# EAGLE design Reaccion-Minimo (EAGLE 7.4.0)
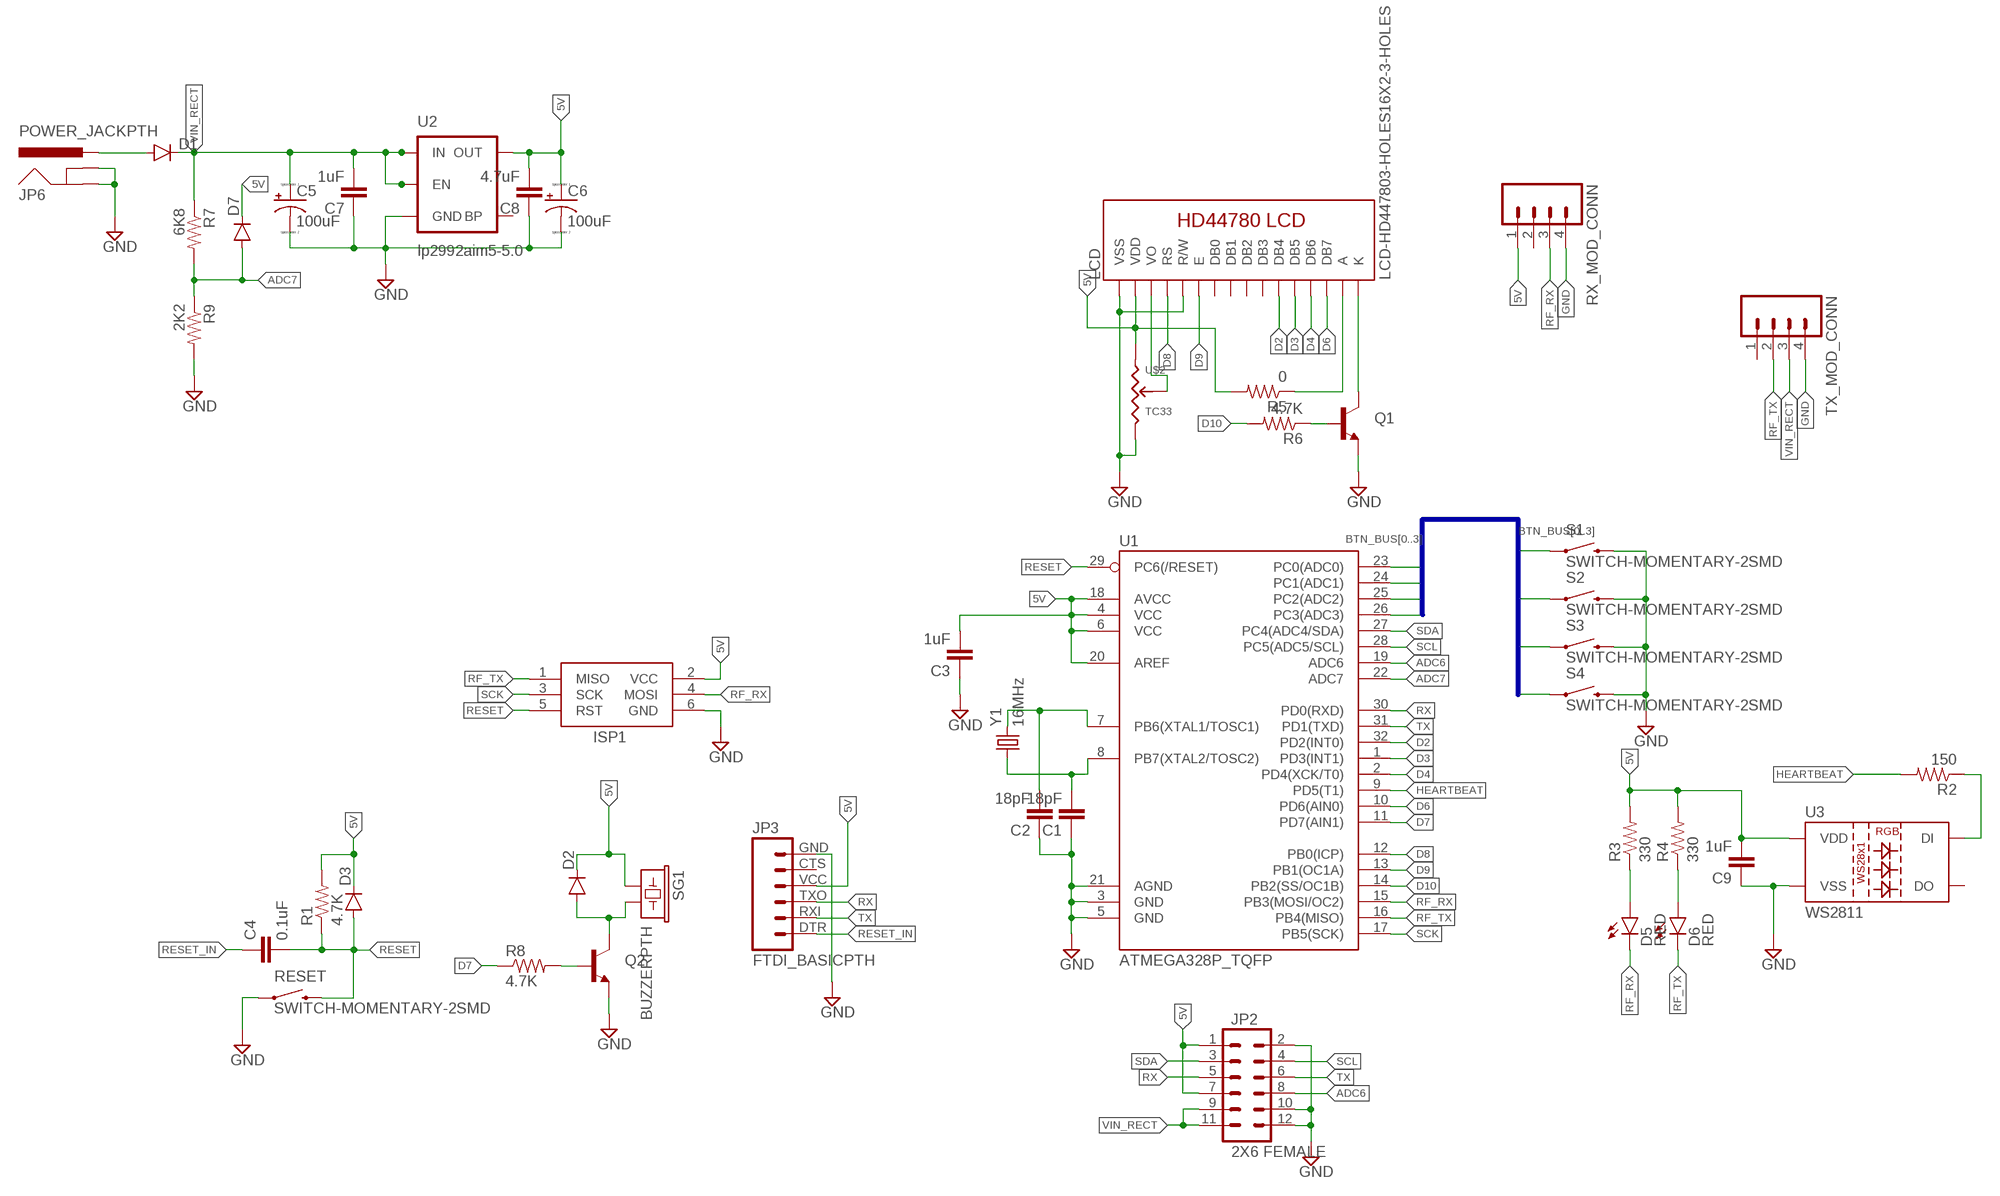
[diagram p0: schematic, sheet 1]

## Parts
C1  18pF  CAP0805  [0805]
C2  18pF  CAP0805  [0805]
C3  1uF  CAP0805  [0805]
C4  0.1uF  CAP0805  [0805]
C5  100uF  CPOL-USC/6032-28R  [C/6032-28R]
C6  100uF  CPOL-USB/3528-21R  [T/3528-12R]
C7  1uF  CAP0805  [0805]
C8  4.7uF  CAP0805  [0805]
C9  1uF  CAP0805  [0805]
D1  DIODESMB  [SMB-DIODE]
D2  DIODESOD123  [SOD-123]
D3  DIODESOD123  [SOD-123]
D5  RED  LED-RED1206  [LED-1206]
D6  RED  LED-RED1206  [LED-1206]
D7  DIODESOD123  [SOD-123]
ISP1  AVRISP-6  [AVRISP]
JP2  2X6 FEMALE  M06X2PTH_FEMALE  [2X6]
JP3  FTDI_BASICPTH  [FTDI_BASIC]
JP6  POWER_JACKPTH  [POWER_JACK_PTH]
LCD  LCD-HD447803-HOLES16X2-3-HOLES  [LCD-16X2-3HOLES]
Q1  TRANSISTOR_NPNSOT23-3  [SOT23-3]
Q2  TRANSISTOR_NPNSOT23-3  [SOT23-3]
R1  4.7K  RESISTOR0805-RES  [0805]
R2  150  RESISTOR0805-RES  [0805]
R3  330  RESISTOR0805-RES  [0805]
R4  330  RESISTOR0805-RES  [0805]
R5  0  RESISTOR0805-RES  [0805]
R6  4.7K  RESISTOR0805-RES  [0805]
R7  6K8  RESISTOR0805-RES  [0805]
R8  4.7K  RESISTOR0805-RES  [0805]
R9  2K2  RESISTOR0805-RES  [0805]
RESET  SWITCH-MOMENTARY-2SMD  [TACTILE-SWITCH-SMD]
RX_MOD_CONN  M04PTH  [1X04]
S1  SWITCH-MOMENTARY-2SMD  [TACTILE-SWITCH-SMD]
S2  SWITCH-MOMENTARY-2SMD  [TACTILE-SWITCH-SMD]
S3  SWITCH-MOMENTARY-2SMD  [TACTILE-SWITCH-SMD]
S4  SWITCH-MOMENTARY-2SMD  [TACTILE-SWITCH-SMD]
SG1  BUZZERPTH  [BUZZER-12MM]
TX_MOD_CONN  M04PTH  [1X04]
U1  ATMEGA328P_TQFP  [TQFP32-08]
U2  lp2992aim5-5.0  V_REG_MIC52195V  [SOT23-5]
U3  WS2811  LED-TRICOLOR-5050-ICWS2811  [LED-TRICOLOR-5050-IC]
U$2  TC33  [TC33]
Y1  16MHz  CRYSTAL5X3  [CRYSTAL-SMD-5X3]

## Nets
5V: C3.2 C6.+ C8.2 C9.2 D2.C D3.C D7.C ISP1.2(VCC) JP2.1 JP2.7 JP3.VCC LCD.2(VDD) R1.2 R3.2 R4.2 R5.2 RX_MOD_CONN.1 SG1.+ U1.4(VCC) U1.6(VCC) U1.18(AVCC) U1.20(AREF) U2.5(OUT) U3.3(VDD) U3.5(VDD) U$2.1
ADC6: JP2.8 U1.19(ADC6)
ADC7: D7.A R7.2 R9.1 U1.22(ADC7)
BTN_BUS0: S1.1 U1.23(PC0(ADC0))
BTN_BUS1: S2.1 U1.24(PC1(ADC1))
BTN_BUS2: S3.1 U1.25(PC2(ADC2))
BTN_BUS3: S4.1 U1.26(PC3(ADC3))
D2: LCD.11(DB4) U1.32(PD2(INT0))
D3: LCD.12(DB5) U1.1(PD3(INT1))
D4: LCD.13(DB6) U1.2(PD4(XCK/T0))
D6: LCD.14(DB7) U1.10(PD6(AIN0))
D7: R8.1 U1.11(PD7(AIN1))
D8: LCD.4(RS) U1.12(PB0(ICP))
D9: LCD.6(E) U1.13(PB1(OC1A))
D10: R6.2 U1.14(PB2(SS/OC1B))
GND: C1.1 C2.1 C3.1 C5.- C6.- C7.1 C8.1 C9.1 ISP1.6(GND) JP2.2 JP2.10 JP2.12 JP3.GND JP6.GND JP6.GNDBREAK LCD.1(VSS) LCD.5(R/W) Q1.2(E) Q2.2(E) R9.2 RESET.1 RX_MOD_CONN.4 S1.3 S2.3 S3.3 S4.3 TX_MOD_CONN.4 U1.3(GND) U1.5(GND) U1.21(AGND) U2.2(GND) U3.6(VSS) U$2.3
HEARTBEAT: R2.2 U1.9(PD5(T1))
N$1: C2.2 U1.7(PB6(XTAL1/TOSC1)) Y1.3
N$2: C1.2 U1.8(PB7(XTAL2/TOSC2)) Y1.1
N$3: R2.1 U3.2(DI)
N$4: D5.A R3.1
N$5: D6.A R4.1
N$6: LCD.15(A) R5.1
N$7: LCD.3(VO) U$2.2
N$8: LCD.16(K) Q1.3(C)
N$9: Q1.1(B) R6.1
N$11: D2.A Q2.3(C) SG1.-
N$12: Q2.1(B) R8.2
RESET: C4.2 D3.A ISP1.5(RST) R1.1 RESET.3 U1.29(PC6(/RESET))
RESET_IN: C4.1 JP3.DTR
RF_RX: D5.C ISP1.4(MOSI) RX_MOD_CONN.3 U1.15(PB3(MOSI/OC2))
RF_TX: D6.C ISP1.1(MISO) TX_MOD_CONN.2 U1.16(PB4(MISO))
RX: JP2.5 JP3.TXO U1.30(PD0(RXD))
SCK: ISP1.3(SCK) U1.17(PB5(SCK))
SCL: JP2.4 U1.28(PC5(ADC5/SCL))
SDA: JP2.3 U1.27(PC4(ADC4/SDA))
TX: JP2.6 JP3.RXI U1.31(PD1(TXD))
VIN: D1.A JP6.PWR
VIN_RECT: C5.+ C7.2 D1.C JP2.9 JP2.11 R7.1 TX_MOD_CONN.3 U2.1(IN) U2.3(EN)
Unconnected: JP3.CTS LCD.7(DB0) LCD.8(DB1) LCD.9(DB2) LCD.10(DB3) RX_MOD_CONN.2 TX_MOD_CONN.1 U2.4(BP) U3.1(DO)

## Buses
BTN_BUS[0..3]

## Library data of the parts
C1-C4 C7-C9 = SparkFun-Capacitors:CAP: Capacitor Standard 0603 ceramic capacitor, and 0.1" leaded capacitor.
C5 C6 = resistor:CPOL-US: POLARIZED CAPACITOR, American symbol
D1 = SparkFun-DiscreteSemi:DIODE: Diode These are standard reverse protection diodes and small signal diodes. SMA package can handle up to about 1A. SOD-323 can handle about 200mA. What the SOD-323 package when ordering, there are some mfgs out there that are 5-pin packages.; PROD_ID: DIO-09646
D2 D3 D7 = SparkFun-DiscreteSemi:DIODE: Diode These are standard reverse protection diodes and small signal diodes. SMA package can handle up to about 1A. SOD-323 can handle about 200mA. What the SOD-323 package when ordering, there are some mfgs out there that are 5-pin packages.
D5 D6 = SparkFun-LED:LED-RED: Assorted Red LEDs LilyPad 1206- DIO-09912 1206- DIO-00809 0603- DIO-00819 "SMART" means more efficient and expensive; PROD_ID: DIO-09912
ISP1 = adafruit:AVRISP: AVR ISP HEADER Standard 6 pin header for AVR programming
JP2 = SparkFun-Connectors:M06X2; PROD_ID: CONN-12423
JP3 = SparkFun-Connectors:FTDI_BASIC: FTDI Basic header with labels
JP6 = SparkFun-Connectors:POWER_JACK: Power Jack This is the standard 5.5mm barrel jack for power. The PTH is the most common, proven, reliable, footprint. The Slot footprint only works if the mill layer is transmitted to the PCB fab house so be warned. Mating wall wart : TOL-00298 (and others); PROD_ID: CONN-08197
LCD = HD44780LCD:LCD-HD44780
Q1 Q2 = SparkFun-DiscreteSemi:TRANSISTOR_NPN: Generic NPN BJT MMBT2222A - TRANS-08049 (SOT-23, 1A 40V) MPSA42 - TRANS-09116 (SOT-23, 500mA 300V) MMBT5088LT1G - TRANS-11160 (SOT-23, 50 mA 30V) BC547 - COM-08928 <http://www.sparkfun.com/products/8928> (TO-92 45V 100mA) (1.Collector 2.Base 3.Emitter) 2N3904 - COM-00521 <http://www.sparkfun.com/products/521> (TO-92 40V 200mA) (1.Emitter 2.Base 3.Collector) P2N2222A - COM-12852 <http://www.sparkfun.com/products/12852> (TO-92 40V 600mA) (1.Collector 2.Base 3.Emitter); PROD_ID: TRANS-08049
R1-R9 = SparkFun-Resistors:RESISTOR: Resistor Basic schematic elements and footprints for 0603, 1206, and PTH resistors.
RESET S1-S4 = SparkFun-Electromechanical:SWITCH-MOMENTARY-2: Various NO switches- pushbuttons, reed, etc; PROD_ID: SWCH-08247
RX_MOD_CONN TX_MOD_CONN = SparkFun-Connectors:M04: Header 4 Standard 4-pin 0.1" header. Use with straight break away headers (SKU : PRT-00116), right angle break away headers (PRT-00553), swiss pins (PRT-00743), machine pins (PRT-00117), and female headers (PRT-00115). Molex polarized connector foot print use with SKU : PRT-08231 with associated crimp pins and housings. 1MM SMD Version SKU: PRT-10208
SG1 = SparkFun-Electromechanical:BUZZER: Buzzer 12mm Spark Fun Electronics SKU : Comp-Buzzer
U1 = SparkFun-DigitalIC:ATMEGA328P_TQFP; PROD_ID: IC-09069
U2 = SparkFun-PowerIC:V_REG_MIC5219: V_REG MIC5219 Standard 3.3V and 5V 500mA LDO voltage regulator in SOT-23 layout. Micrel part MIC5219. BP (by-pass) pin is used to lower output noise with 470pF cap, may be left open.; PROD_ID: VREG-10107; VALUE: MIC5219 5V
U3 = SparkFun-LED:LED-TRICOLOR-5050-IC: WS2812 RGB LED w/ WS2811 driver 5x5mm SMD LED with built-in controller IC. DIO-11598; PROD_ID: DIO-11598
U$2 = Reaccion-Minimo:TC33
Y1 = SparkFun-FreqCtrl:CRYSTAL: Various standard crystals. Proven footprints.; PROD_ID: XTAL-08218

## Board
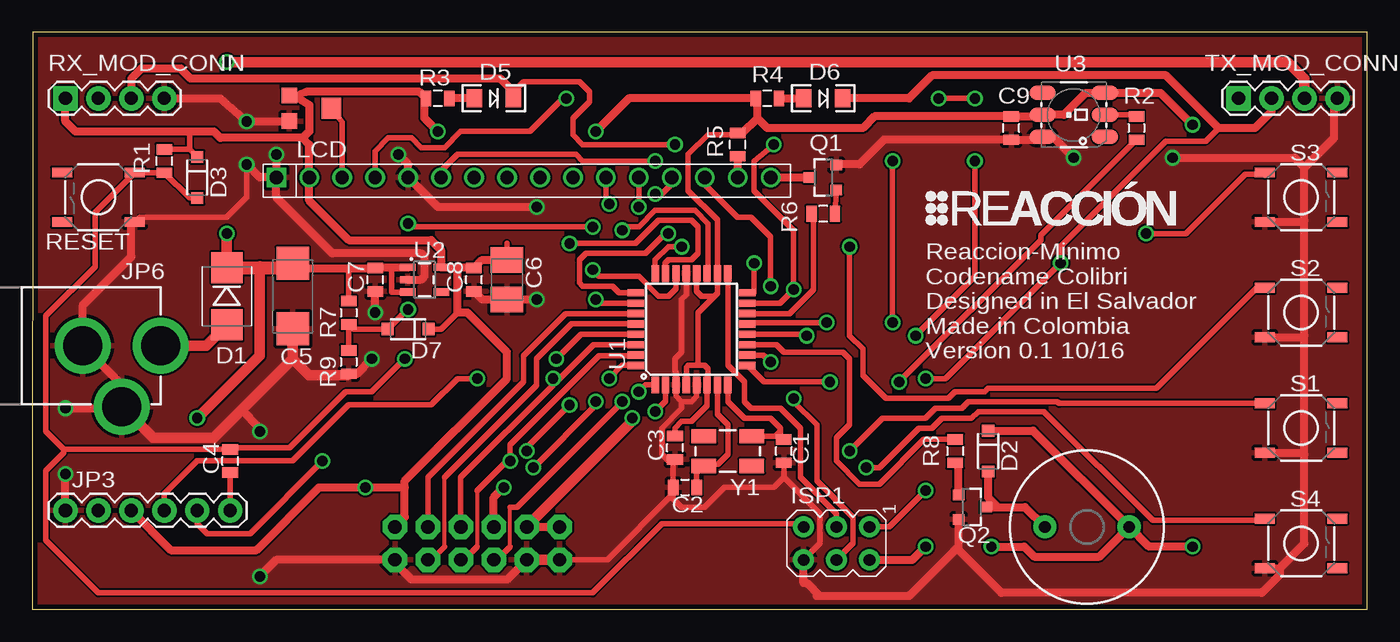
[diagram p1: board, top side]
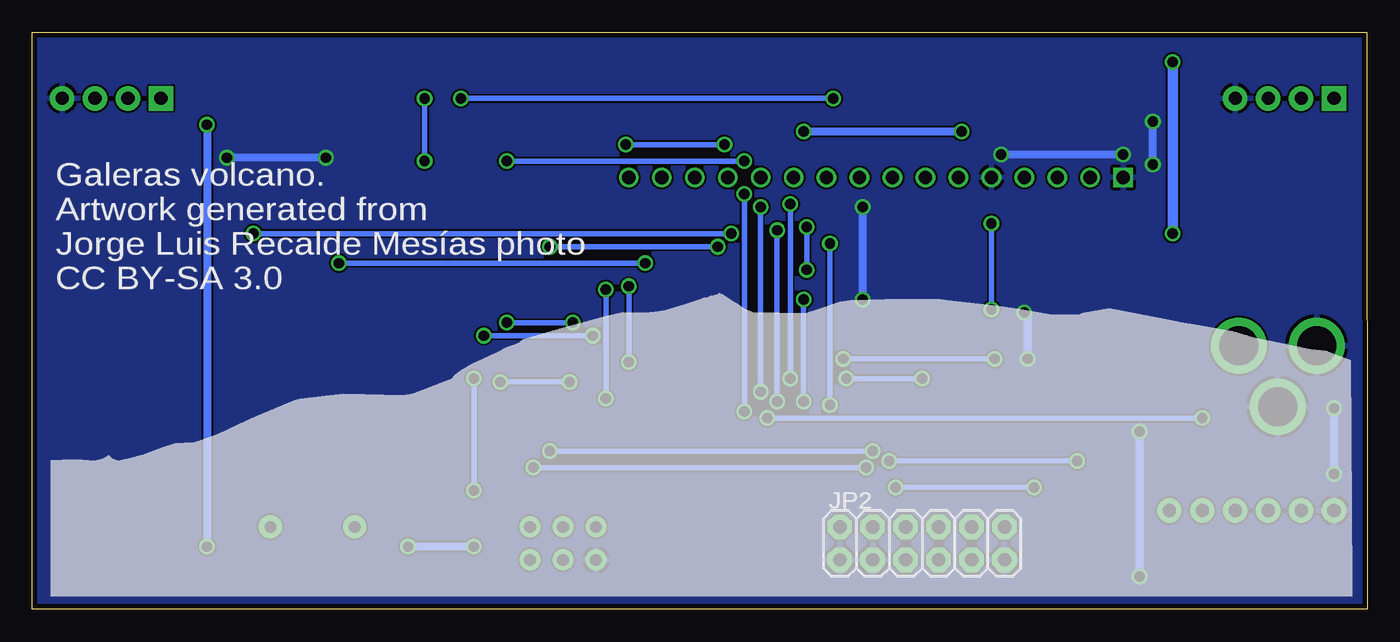
[diagram p2: board, bottom side, seen from below]

Size 102.87 x 44.45 mm. Coordinates in mm from the lower left corner, seen from the top.
Outline: 0,0 102.87,0 102.87,44.45 0.01,44.45 0,0
Copper layers (1*16): Top 0.0356mm / dielectric 1.5011mm / Bottom 0.0356mm
Design rules "LaenPCBOrder": minimum track width 6mil, minimum drill 13mil, track to track 6mil, track to pad 6mil, pad to pad 6mil, via to via 6mil, smd to smd 6mil, copper to edge 15mil, drill to drill 6mil, minimum pad ring 7mil, minimum via ring 7mil, stop-mask expansion 3mil, vias tented up to drill 0mil, thermal gap 10mil

### Footprints (pad centres in the part's own frame; a part is rotated, then mirrored left to right if it is on the bottom)
0805 = smd 0.8 x 1.2: 1 -0.9,0; 2 0.9,0
C/6032-28R = smd 2.55 x 2.5: + 2.525,0; - -2.525,0
T/3528-12R = smd 1.95 x 2.5: + 1.525,0; - -1.525,0
SMB-DIODE = smd 2.4 x 2.4: A 2.2,0; C -2.2,0
SOD-123 = smd 0.9 x 0.95: A 1.575,0; C -1.575,0
LED-1206 = smd 1.2 x 1.4: A -1.5,0; C 1.5,0
AVRISP = drill 0.9 pad 1.626: 1 -1.27,2.54; 2 1.27,2.54; 3 -1.27,0; 4 1.27,0; 5 -1.27,-2.54; 6 1.27,-2.54
2X6 = drill 1.016 pad 1.88 octagon: 1 0,0; 2 0,2.54; 3 2.54,0; 4 2.54,2.54; 5 5.08,0; 6 5.08,2.54; 7 7.62,0; 8 7.62,2.54; 9 10.16,0; 10 10.16,2.54; 11 12.7,0; 12 12.7,2.54
FTDI_BASIC = drill 1.016 pad 1.88: CTS 10.16,0; DTR 0,0; GND 12.7,0; RXI 2.54,0; TXO 5.08,0; VCC 7.62,0
POWER_JACK_PTH = drill 2.997 pad 4.318: GND 0,7.7; GNDBREAK 4.7,10.7; PWR 0,13.7
LCD-16X2-3HOLES = drill 1.016 square: 1 -32,15.5 | drill 1.016: 2 -29.46,15.5; 3 -26.92,15.5; 4 -24.38,15.5; 5 -21.84,15.5; 6 -19.3,15.5; 7 -16.76,15.5; 8 -14.22,15.5; 9 -11.68,15.5; 10 -9.14,15.5; 11 -6.6,15.5; 12 -4.06,15.5; 13 -1.52,15.5; 14 1.02,15.5; 15 3.56,15.5; 16 6.1,15.5
SOT23-3 = smd 0.8 x 0.9: 1 -0.95,-1; 2 0.95,-1; 3 0,1.1
TACTILE-SWITCH-SMD = smd 1.524 x 0.762: 1 -2.794,1.905; 2 2.794,1.905; 3 -2.794,-1.905; 4 2.794,-1.905
1X04 = drill 1.016 pad 1.88 square: 1 0,0 | drill 1.016 pad 1.88: 2 2.54,0; 3 5.08,0; 4 7.62,0
BUZZER-12MM = drill 0.9 pad 1.778: + 3.25,0; - -3.25,0
TQFP32-08 = smd 1.27 x 0.559: 1 -4.293,2.8; 2 -4.293,2; 3 -4.293,1.2; 4 -4.293,0.4; 5 -4.293,-0.4; 6 -4.293,-1.2; 7 -4.293,-2; 8 -4.293,-2.8; 17 4.293,-2.8; 18 4.293,-2; 19 4.293,-1.2; 20 4.293,-0.4; 21 4.293,0.4; 22 4.293,1.2; 23 4.293,2; 24 4.293,2.8 | smd 0.559 x 1.27: 9 -2.8,-4.293; 10 -2,-4.293; 11 -1.2,-4.293; 12 -0.4,-4.293; 13 0.4,-4.293; 14 1.2,-4.293; 15 2,-4.293; 16 2.8,-4.293; 25 2.8,4.293; 26 2,4.293; 27 1.2,4.293; 28 0.4,4.293; 29 -0.4,4.293; 30 -1.2,4.293; 31 -2,4.293; 32 -2.8,4.293
SOT23-5 = smd 0.55 x 1.2: 1 -0.95,-1.3; 2 0,-1.3; 3 0.95,-1.3; 4 0.95,1.3; 5 -0.95,1.3
LED-TRICOLOR-5050-IC = smd 2 x 1.1: 1 -2.4,1.7; 2 -2.4,0; 3 -2.4,-1.7; 4 2.4,-1.7; 5 2.4,0; 6 2.4,1.7
TC33 = smd 1.194 x 1.194: 1 -0.991,-1.791; 3 0.991,-1.791 | smd 1.6 x 1.499: 2 0,1.46
CRYSTAL-SMD-5X3 = smd 1.9 x 1.1: 1 -1.85,-1.15; 2 1.85,-1.15; 3 1.85,1.15; 4 -1.85,1.15

### Placement (x,y rotation side)
C1  57.91,12.19 90 top
C2  50.29,9.4 0 top
C3  49.53,12.45 90 top
C4  15.24,11.43 90 top
C5  20.07,24.13 90 top
C6  36.58,25.4 90 top
C7  26.42,25.4 90 top
C8  34.04,25.4 90 top
C9  75.44,37.08 90 top
D1  14.99,24.13 270 top
D2  73.66,12.19 270 top
D3  12.7,33.27 270 top
D5  35.56,39.37 0 top
D6  60.96,39.37 0 top
D7  28.96,21.59 180 top
ISP1  61.98,5.08 270 top
JP2  27.94,6.35 180 bottom
JP3  15.24,7.62 180 top
JP6  -3.81,20.32 270 top
LCD  50.8,17.78 0 top
Q1  60.96,33.27 90 top
Q2  72.39,7.87 270 top
R1  10.16,34.54 90 top
R2  85.09,37.08 270 top
R3  31.24,39.37 180 top
R4  56.64,39.37 180 top
R5  54.36,35.81 90 top
R6  60.96,30.48 180 top
R7  24.38,22.86 270 top
R8  71.12,12.19 270 top
R9  24.38,19.05 270 top
RESET  5.08,31.75 180 top
RX_MOD_CONN  2.54,39.37 0 top
S1  97.79,13.97 0 top
S2  97.79,22.86 0 top
S3  97.79,31.75 0 top
S4  97.79,5.08 0 top
SG1  81.28,6.35 0 top
TX_MOD_CONN  92.96,39.37 0 top
U1  50.8,21.59 90 top
U2  30.23,25.4 270 top
U3  80.26,38.1 180 top
U$2  21.59,38.61 270 top
Y1  53.59,12.19 180 top

### Tracks (layer width: path | path; a pad name or v marks a point on that pad's centre or on a via)
5V  (via drill 0.8)
  Top 0.406: D7.C 31.5,21.59 32.77,22.86 | R1.2 12.11,35.44 | 12.11,35.44 D3.C | 12.11,35.44 12.11,36.74 12.19,36.83 | 20.6,39.65 20.6,39.34 | 30.23,39.25 R3.2 | 52.58,24.13 52.8,24.35 U1.18 52.8,30 50.55,32.26 50.55,35.05 52.07,36.58 54.22,36.58 R5.2 | 52.58,24.13 51.56,24.13 51.2,24.49 U1.20 | 52.58,24.13 51.31,22.86 51.31,18.8 | 51.31,18.8 51.82,18.8 52.07,18.54 52.07,17.37 U1.6 | U1.6 52,17.34 | U1.4 50.4,18.65 50.55,18.8 51.31,18.8 | U1.6 52,15.68 50.8,14.48 50.04,14.48 49.53,13.97 C3.2 | 36.58,28.19 C6.+
  Top 0.61: 32.77,26.35 U2.5 31.5,26.38 31.5,27.69 30.73,28.45 24.38,28.45 21.34,31.5 LCD.2 21.34,35.81 20.83,36.32 | 32.77,26.35 33.99,26.35 arc-90 C8.2 34.66,26.93 C6.+ | 32.77,26.35 32.77,22.86 33.53,22.86 36.58,19.81 36.58,17.78 28.7,9.91 28.7,9.4 | RX_MOD_CONN.1 2.54,37.59 3.3,36.83 12.19,36.83 13.97,36.83 14.48,36.32 20.83,36.32 | U$2.1 20.6,39.34 21.34,38.86 21.34,36.83 20.83,36.32 | R3.2 29.83,39.88 21.08,39.88 20.6,39.65 | v43.43,36.83 45.97,39.37 R4.2 55.88,39.23 55.88,37.85 | v31.24,36.83 30.23,37.85 30.23,39.25 | 55.88,37.85 56.64,37.08 64.01,37.08 64.91,37.98 C9.2 77.75,37.98 U3.5 79.5,38.1 81.2,39.8 U3.3 86.95,39.8 v89.41,37.34 | R5.2 54.75,36.71 55.88,37.85 | JP2.1 28.7,7.11 28.7,9.4 | JP2.7 35.56,8.64 v36.32,9.4 | 28.7,9.4 v25.65,9.4 22.1,9.4 17.27,4.57 10.67,4.57 JP3.VCC | ISP1.2 67.82,3.81 v68.83,4.83 | v73.91,4.83 76.45,4.83 77.22,4.06 82.24,4.06 SG1.+ | D2.C 77.11,13.77 SG1.+ | v89.41,4.83 86.05,4.83 SG1.+
  Bottom 0.406: v36.32,9.4 v25.65,9.4
  Bottom 0.61: v43.43,36.83 v31.24,36.83 | v68.83,4.83 v73.91,4.83 | v89.41,37.34 v89.41,4.83
ADC6  (via drill 0.8)
  Top 0.305: 36.83,4.83 36.83,7.87
  Top 0.406: JP2.8 35.81,3.81 36.83,4.83 | U1.19 52.07,25.95 52.07,29.72 51.05,30.73 48.01,30.73 46.74,29.46 45.72,29.46 v45.47,29.21 | 36.83,7.87 37.34,7.87 v45.47,16
  Bottom 0.406: v45.47,16 v45.47,29.21
ADC7  (via drill 0.8)
  Top 0.406: R9.1 R7.2 24.75,21.59 D7.A 28.91,23.11 v28.96,23.11 | U1.22 49.6,24.71 49.02,24.13 48.26,24.13 46.74,25.65 43.69,25.65 v43.18,26.16 | v43.18,29.46 29.21,29.46 v28.96,29.72
  Bottom 0.406: v43.18,26.16 v43.18,29.46 | v28.96,29.72 v28.96,23.11
BTN_BUS0  (via drill 0.8)
  Top 0.406: v38.1,12.19 38.1,12.45 v41.4,15.75 | U1.23 48.77,25.91 48.77,26.67 49.02,26.92 50.8,26.92 51.31,27.43 51.31,29.46 50.8,29.97 48.26,29.97 46.48,28.19 v41.4,28.19 | S1.1 79.12,15.88 78.99,16 72.14,16 71.63,15.49 69.6,15.49 68.83,14.73 65.53,14.73 v62.99,12.19
  Bottom 0.406: v62.99,12.19 v38.1,12.19 | v41.4,15.75 v41.4,28.19
BTN_BUS1  (via drill 0.8)
  Top 0.406: U1.24 48.01,26.92 49.02,27.94 v50.04,27.94 | v62.99,27.94 62.99,21.08 64.01,20.07 64.01,18.03 65.79,16.26 70.61,16.26 71.12,16.76 73.41,16.76 73.66,17.02 86.61,17.02 94.36,24.77 S2.1
  Bottom 0.406: v50.04,27.94 v62.99,27.94
BTN_BUS2  (via drill 0.8)
  Top 0.406: U1.25 45.21,24.38 44.7,24.89 42.42,24.89 42.16,25.15 42.16,26.92 42.67,27.43 47.24,27.43 48.77,28.96 v49.02,28.96 | 95,33.53 93.47,33.53 88.9,28.96 v85.85,28.96
  Top 0.61: S3.1 95,33.53
  Bottom 0.406: v49.02,28.96 v85.85,28.96
BTN_BUS3  (via drill 0.8)
  Top 0.406: v43.43,23.88 43.72,23.59 U1.26 | v38.61,10.92 43.43,15.75 v43.43,16 | v64.26,10.92 65.28,10.92 68.33,13.97 69.34,13.97 70.1,14.73 72.39,14.73 72.9,15.24 77.98,15.24 86.36,6.86 95,6.86 S4.1
  Bottom 0.406: v43.43,16 v43.43,23.88 | v64.26,10.92 v38.61,10.92
D2  (via drill 0.8)
  Top 0.406: U1.32 45.46,18.79 v44.45,17.78 | v44.45,31.24 44.2,31.49 LCD.11
  Bottom 0.406: v44.45,17.78 v44.45,31.24
D3  (via drill 0.8)
  Top 0.406: LCD.12 46.74,30.74 v46.74,30.99 | U1.1 47.27,17.3 v46.74,16.76
  Bottom 0.406: v46.74,16.76 v46.74,30.99
D4  (via drill 0.8)
  Top 0.406: U1.2 48.8,16.03 v48.01,15.24 | v48.01,32 48.51,32 49.28,32.77 LCD.13
  Bottom 0.406: v48.01,15.24 v48.01,32
D6  (via drill 0.8)
  Top 0.406: U1.10 56.36,19.59 v56.9,19.05 | LCD.14 51.82,32.76 54.36,30.23 55.37,30.23 56.9,28.7 v56.9,24.89
  Bottom 0.406: v56.9,19.05 v56.9,24.89
D7
  Top 0.406: R8.1 68.72,13.09 65.28,9.65 63.75,9.65 61.98,11.43 61.98,13.21 62.99,14.22 62.99,19.3 62.48,19.81 57.91,19.81 57.33,20.39 U1.11 55.16,20.32
D8  (via drill 0.8)
  Top 0.406: U1.12 59.58,21.19 v59.69,21.08 | v41.15,39.37 40.89,39.37 38.35,36.83 33.02,36.83 31.75,35.56 29.97,35.56 29.21,36.32 27.43,36.32 26.42,35.31 LCD.4 | v69.85,39.37 v72.64,39.37 | v72.64,34.54 72.64,25.65 v68.07,21.08
  Bottom 0.406: v59.69,21.08 v68.07,21.08 | v69.85,39.37 v41.15,39.37 | v72.64,39.37 v72.64,34.54
D9  (via drill 0.8)
  Top 0.406: LCD.6 31.5,33.79 32.77,35.05 41.91,35.05 42.42,34.54 v48.01,34.54 | v61.21,22.1 55.2,22.1 U1.13 | v66.29,22.1 v66.29,34.54
  Bottom 0.406: v48.01,34.54 v66.29,34.54 | v66.29,22.1 v61.21,22.1
D10
  Top 0.406: U1.14 58.35,22.79 60.2,24.64 60.2,30.34 R6.2
GND  (via drill 0.8, 0.8 pad 0.81)
  Top 0.406: v16.51,34.29 16.51,31.75 14.99,30.23 8.26,30.23 RESET.1 | U1.5 51.2,16.4 50.8,16 50.04,16 | 50.04,16 49.6,16.44 U1.3 49.6,18.29 49.53,18.29 49.53,19.3 50.04,19.81 50.04,23.88 50.4,24.24 U1.21 | 50.04,16 50.04,15.49 48.51,13.97 48.51,11.94 49.02,11.43 49.41,11.43 C3.1 49.39,11.41 C2.1 49.39,8.89 | 49.39,8.89 49.39,8.52 50.04,7.87 51.82,7.87 53.34,9.4 57.15,9.4 57.91,10.16 | 57.91,10.16 C1.1 | JP2.12 44.31,3.81 49.39,8.89 | ISP1.6 60.71,5.08 60.71,7.37 57.91,10.16
  Top 0.61: U2.2 29.97,25.4 30.23,25.65 30.23,27.18 29.97,27.43 23.11,27.43 18.8,31.75 LCD.1 | LCD.1 17.52,33.28 v16.51,34.29 | U$2.3 19.77,37.59 v16.51,37.59 14.48,39.37 RX_MOD_CONN.4 | v28.19,35.05 28.96,34.29 LCD.5 31.25,30.99 v38.86,30.99 | v18.8,35.05 LCD.1 | RESET.1 7.62,29.59 7.62,27.18 3.89,23.45 JP6.GND 6.89,17.32 JP6.GNDBREAK 6.76,15.49 v2.54,15.49 | JP3.GND v2.54,10.41 | R9.2 25.01,18.15 v26.16,19.3 | v26.42,22.86 C7.1 | C8.1 34.66,23.88 C6.- v38.86,23.88 | 96.14,3.17 98.04,5.08 98.04,11.94 | 98.04,11.94 98.04,21.08 | 98.04,21.08 98.04,29.97 | 98.04,29.97 98.04,34.04 | 98.04,34.04 100.33,36.32 100.33,39.12 TX_MOD_CONN.4 | S3.3 97.92,29.84 98.04,29.97 | S2.3 97.92,20.95 98.04,21.08 | S1.3 97.92,12.06 98.04,11.94 | Q1.2 62.03,34.29 63.75,34.29 65.65,36.18 C9.1 77.65,36.18 U3.6 78.66,36.4 v80.26,34.8 | Q2.2 71.39,4.84 71.25,4.7 | 71.25,4.7 67.56,1.02 60.71,1.02 | 60.71,1.02 60.45,1.02 | v87.88,34.8 97.28,34.8 98.04,34.04 | ISP1.6 59.44,2.03 59.69,2.03 60.71,1.02 | 37.85,3.56 36.58,2.29 29.21,2.29 27.94,3.56 | 96.14,3.17 96.14,2.67 94.74,1.27 74.68,1.27 71.25,4.7 | S4.3 96.14,3.17 | JP2.2 18.8,3.81 v17.53,2.54 | v17.53,13.72 17.53,13.97 16.13,15.37
  Top 0.813: 20.07,19.3 21.34,18.03 24.27,18.03 R9.2 | 20.07,19.3 16.13,15.37 13.97,13.21 9.3,13.21 JP6.GNDBREAK | 20.07,19.3 C5.- | C6.- | LCD.5 | JP2.12 JP2.10 37.85,3.56
  Bottom 0.61: v16.51,34.29 v16.51,37.59 | v28.19,35.05 v18.8,35.05 | v2.54,10.41 v2.54,15.49 | v26.16,19.3 26.16,22.61 v26.42,22.86 | v80.26,34.8 v87.88,34.8 | v38.86,23.88 v38.86,30.99 | v17.53,2.54 v17.53,13.72
  pour Top: 0,0 0,44.45 102.87,44.45 102.87,0
  pour Bottom: 0,0 0,44.45 102.87,44.45 102.87,0
HEARTBEAT  (via drill 0.8)
  Top 0.406: U1.9 55.12,18.79 56.39,17.53 v61.47,17.53 | R2.2 77.72,28.82 77.72,28.45 v66.8,17.53
  Bottom 0.406: v61.47,17.53 v66.8,17.53
N$1
  Top 0.406: 51.49,11.29 Y1.3 | U1.7 52.8,15.02 53.59,14.22 53.59,11.94 52.83,11.18 51.88,11.18 Y1.3 | C2.2 51.19,10.49 Y1.3
N$2
  Top 0.406: U1.8 53.6,16 54.86,14.73 56.9,14.73 57.66,13.97 57.66,13.72 | 57.66,13.72 57.66,13.35 C1.2 | Y1.1 57.28,13.34 57.66,13.72
N$3
  Top 0.406: U3.2 84.97,38.1 R2.1
N$4
  Top 0.61: D5.A R3.1
N$5
  Top 0.61: R4.1 D6.A
N$6
  Top 0.61: R5.1 LCD.15
N$7
  Top 0.406: U$2.2 23.88,37.52 LCD.3
N$8
  Top 0.61: LCD.16 Q1.3
N$9
  Top 0.406: R6.1 61.98,32.31 Q1.1
N$11
  Top 0.61: Q2.3 74.42,7.87 | 74.42,7.87 76.51,7.87 SG1.- | D2.A 73.66,8.64 74.42,7.87
N$12
  Top 0.61: Q2.1 71.39,11.02 R8.2
RESET  (via drill 0.8)
  Top 0.406: D3.A 12.11,31.7 R1.1 7.88,33.64 RESET.3 4.83,30.61 4.83,26.42 1.02,22.61 1.02,13.72 2.4,12.33 | C4.2 2.4,12.33 | U1.29 42.27,21.19 v40.39,19.3 | v28.7,19.3 26.16,16.76 24.13,16.76 19.81,12.45 15.36,12.45 C4.2 | ISP1.5 59.18,6.6 48.51,6.6 43.18,1.27 5.08,1.27 1.02,5.33 1.02,10.67 2.4,12.05 2.4,12.33 | 15.38,12.19 C4.2
  Bottom 0.406: v40.39,19.3 v28.7,19.3
RESET_IN
  Top 0.406: C4.1 JP3.DTR
RF_RX  (via drill 0.8)
  Top 0.406: U1.15 57.63,23.59 v58.67,24.64 58.67,29.21 55.63,32.26 55.63,34.54 v57.15,35.81 | v58.67,16.26 58.67,16 60.45,14.22 60.45,9.91 63.25,7.11 63.25,5.08 ISP1.4 | 37.08,39.88 37.85,40.64 42.16,40.64 42.93,39.88 42.93,39.12 41.66,37.85 41.66,36.58 42.42,35.81 v49.53,35.81
  Top 0.61: D5.C 37.08,39.39 37.08,39.88 36.07,40.89 12.19,40.89 11.43,41.66 8.38,41.66 7.62,40.89 RX_MOD_CONN.3
  Bottom 0.406: v58.67,24.64 v58.67,16.26 | v49.53,35.81 v57.15,35.81
RF_TX  (via drill 0.8)
  Top 0.406: U1.16 55.63,24.39 55.63,24.4 v55.63,26.67 | ISP1.1 66.04,6.35 v68.83,9.14 | v68.83,17.78 70.36,17.78 v79.25,26.67 79.25,27.94 87.38,36.07 90.42,36.07 91.44,37.08
  Top 0.61: TX_MOD_CONN.2 95.5,38.35 94.23,37.08 91.44,37.08 87.38,41.15 69.34,41.15 67.56,39.37 D6.C
  Bottom 0.406: v55.63,26.67 v79.25,26.67 | v68.83,9.14 v68.83,17.78
RX  (via drill 0.8)
  Top 0.406: U1.30 43.25,20.39 40.64,17.78 v40.13,17.78 40.13,17.27 33.02,10.16 JP2.5 | JP3.TXO 10.16,8.89 12.7,11.43 20.07,11.43 24.38,15.75 30.73,15.75 32.77,17.78 v34.29,17.78
  Bottom 0.406: v34.29,17.78 v40.13,17.78
SCK
  Top 0.406: U1.17 53.59,18.8 54.86,17.53 54.86,16 55.37,15.49 57.66,15.49 59.18,13.97 59.18,10.16 61.98,7.37 ISP1.3
SCL
  Top 0.305: 31.75,4.83 31.75,10.16
  Top 0.406: JP2.4 30.73,3.81 31.75,4.83 | U1.28 41.55,21.99 38.86,19.3 38.86,17.27 31.75,10.16
SDA
  Top 0.406: U1.27 41.08,22.79 37.85,19.56 37.85,17.53 30.48,10.16 JP2.3
TX  (via drill 0.8)
  Top 0.305: 34.29,9.14 34.29,4.83
  Top 0.406: JP2.6 33.27,3.81 34.29,4.83 | U1.31 46.48,19.56 43.69,19.56 36.83,12.7 v36.83,11.43 36.58,11.43 34.29,9.14 | v22.35,11.43 16.76,5.84 13.46,5.84 12.7,6.6 JP3.RXI
  Bottom 0.406: v36.83,11.43 v22.35,11.43
VIN
  Top 0.813: JP6.PWR 13.38,20.32 D1.A
VIN_RECT  (via drill 0.8)
  Top 0.406: R7.1 24.38,26.3 | U2.3 27.69,24.45 27.69,26.35
  Top 0.61: U2.1 27.69,26.35 26.47,26.35 C7.2 24.38,26.3 20.1,26.3 20.07,26.33 | JP2.9 JP2.11
  Top 0.813: TX_MOD_CONN.3 98.04,40.89 96.77,42.16 v14.99,42.16 | v14.99,28.96 D1.C | JP2.9 46.23,14.48 v46.23,14.73 | v12.7,14.73 17.53,19.56 17.53,26.33
  Top 1.016: D1.C 17.53,26.33 20.07,26.33 C5.+
  Bottom 0.406: v46.23,14.73 v12.7,14.73
  Bottom 0.813: v14.99,42.16 v14.99,28.96

### Text on the board
tPlace: Reaccion-Minimo / Codename Colibri / Designed in El Salvador / Made in Colombia / Version 0.1 10/16
bPlace: Galeras volcano. / Artwork generated from / Jorge Luis Recalde Mesías photo / CC BY-SA 3.0